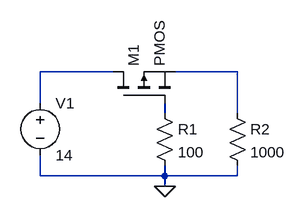
[diagram p0: schematic Draft2.asc]
Draft2.asc, the LTspice schematic file:
Version 4
SHEET 1 880 680
WIRE 80 176 -32 176
WIRE 272 176 176 176
WIRE -32 224 -32 176
WIRE 160 240 160 224
WIRE 272 240 272 176
WIRE -32 336 -32 304
WIRE 160 336 160 320
WIRE 160 336 -32 336
WIRE 272 336 272 320
WIRE 272 336 160 336
WIRE 160 352 160 336
FLAG 160 352 0
SYMBOL pmos 80 224 R270
SYMATTR InstName M1
SYMBOL res 144 224 R0
SYMATTR InstName R1
SYMATTR Value 100
SYMBOL voltage -32 208 R0
SYMATTR InstName V1
SYMATTR Value 14
SYMBOL res 256 224 R0
SYMATTR InstName R2
SYMATTR Value 1000

The netlist it stands for:
* Draft2.asc
M1 N001 N003 N002 N002 PMOS
R1 N003 0 100
V1 N001 0 14
R2 N002 0 1000
.model NMOS NMOS
.model PMOS PMOS
.lib standard.mos
.backanno
.end